# Altium schematic sheet Sheet2.SchDoc
size A4; SheetNumber: 1; SheetTotal: 1; SPICEModelCacheQDWGKKNU: <root> / <DocumentId>QDWGKKNU</DocumentId> / <CacheFrame Number="0"> / <Model Name="bridge" Kind="CKT"> / <Text>*Default Diode Bridge Rectifier / *Connections: / *              V- / *              | AC1 / *              | | V+ / *              | | | AC2 / *              | | | | / .SUBCKT BRIDGE 1 2 3 4 / D1 1 2 DMOD / D2 1 4 DMOD / D3 2 3 DMOD / D4 4 3 DMOD / .MODEL DMOD D () / .ENDS BRIDGE</Text> / </Model> / <Model Name="cap" Kind="MDL"> / <Text>*Default semiconductor capacitor / .MODEL CAP C()</Text> / </Model> / <Model Name="led0" Kind="MDL"> / <Text>*Typ INFRARED GaAs LED: Vf=1.2V Vr=5V If=40mA trr=3uS / *LED Pinout: 1=A, 2=K / .MODEL LED0 D (IS=93.5P RS=84M N=2.63 BV=5 IBV=10U / + CJO=2.97P VJ=.75 M=.333 TT=4.32U)</Text> / </Model> / </CacheFrame> / </root>
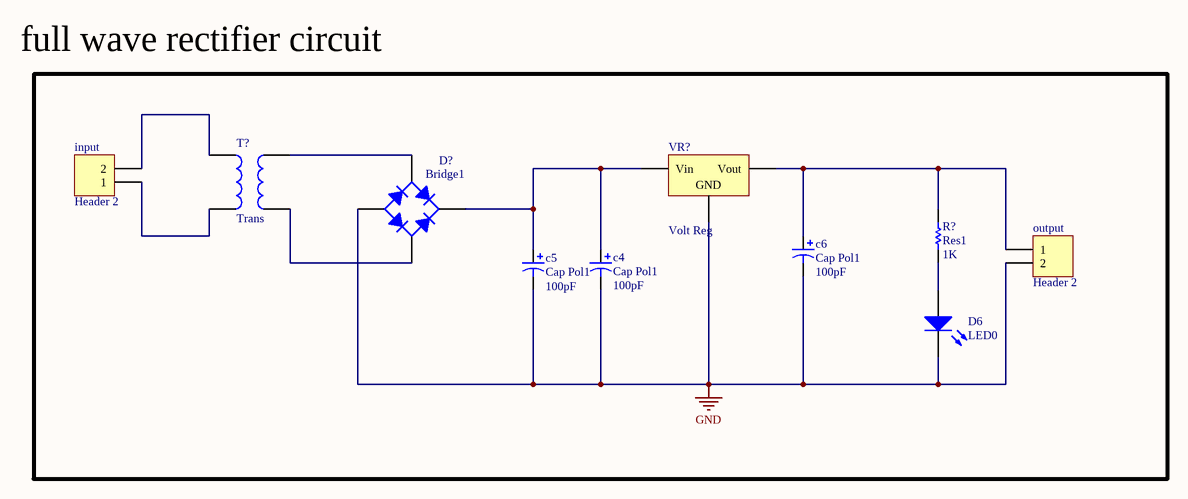
[diagram p0: Sheet2.SchDoc]

## Parts
c4  Cap Pol1  value 100pF  [RB7.6-15]
c5  Cap Pol1  value 100pF  [RB7.6-15]
c6  Cap Pol1  value 100pF  [RB7.6-15]
D6  LED0  [LED-0]
D?  Bridge1  [D-38]
input  Header 2  [HDR1X2]
output  Header 2  [HDR1X2]
R?  Res1  value 1K  [AXIAL-0.3]
T?  Trans  [TRANS]
VR?  Volt Reg  [D2PAK_N]

## Nets
GND: c4.2 c5.2 c6.2 D6.2(K) D?.3(A) output.2 VR?.2(GND)
Netc4_1: c4.1 c5.1 D?.1(K) VR?.1(Vin)
Netc6_1: c6.1 output.1 R?.1 VR?.3(Vout)
NetD6_1: D6.1(A) R?.2
NetD?_2: D?.2(C) T?.4
NetD?_4: D?.4(C) T?.3
Netinput_1: input.1 T?.2
Netinput_2: input.2 T?.1

## Notes on the sheet
- full wave rectifier circuit

## Library data of the parts
c4-c6 = Cap Pol1: Polarized Capacitor (Radial); Published: 8-Jun-2000; LatestRevisionDate: 17-Jul-2002; LatestRevisionNote: Re-released for DXP Platform.; PackageReference: RB7.6-15; Publisher: Altium Limited; PackageDescription: Polarized Capacitor (Radial); 2 Leads
D6 = LED0: Typical INFRARED GaAs LED; Published: 8-Jun-2000; LatestRevisionDate: 08-Jul-2005; LatestRevisionNote: Mech Layer 1 removed.; PackageReference: LED-0; Publisher: Altium Limited; PackageDescription: LED; 2 Leads
D? = Bridge1: Full Wave Diode Bridge; Published: 8-Jun-2000; LatestRevisionDate: 29-May-2009; LatestRevisionNote: Sch pins A & K swapped.; DatasheetVersion: E2732B; PackageReference: D-38; Publisher: Altium Limited; PackageDescription: Bridge Rectifier; 4 Terminals; Body 9.4 x 9.4 mm (typ); Pitch 5.08 mm
input output = Header 2: Header, 2-Pin; LatestRevisionDate: 17-Jul-2002; LatestRevisionNote: Re-released for DXP Platform.; Publisher: Altium Limited
R? = Res1: Resistor; Published: 8-Jun-2000; LatestRevisionDate: 17-Jul-2002; LatestRevisionNote: Re-released for DXP Platform.; PackageReference: AXIAL-0.3; Publisher: Altium Limited; PackageDescription: Axial Device, Thru-Hole; 2 Leads; 0.3 in Pin Spacing
T? = Trans: Transformer; Published: 24-Mar-1999; LatestRevisionDate: 08-Jul-2005; LatestRevisionNote: Mech Layer 1 removed.; PackageReference: TRANS; Publisher: Altium Limited; PackageDescription: Transformer; 4 Leads
VR? = Volt Reg: Voltage Regulator; Published: 24-Mar-1999; LatestRevisionDate: 29-May-2009; LatestRevisionNote: IPC-7351 Footprint Added.; PackageReference: D2PAK; Publisher: Altium Limited; PackageDescription: 3-Pin Transistor Outline Package 2.54 mm Pitch, 15.1 mm Lead Span